# Altium project ESP32-power-controller.PrjPcb (part 1 of 2)
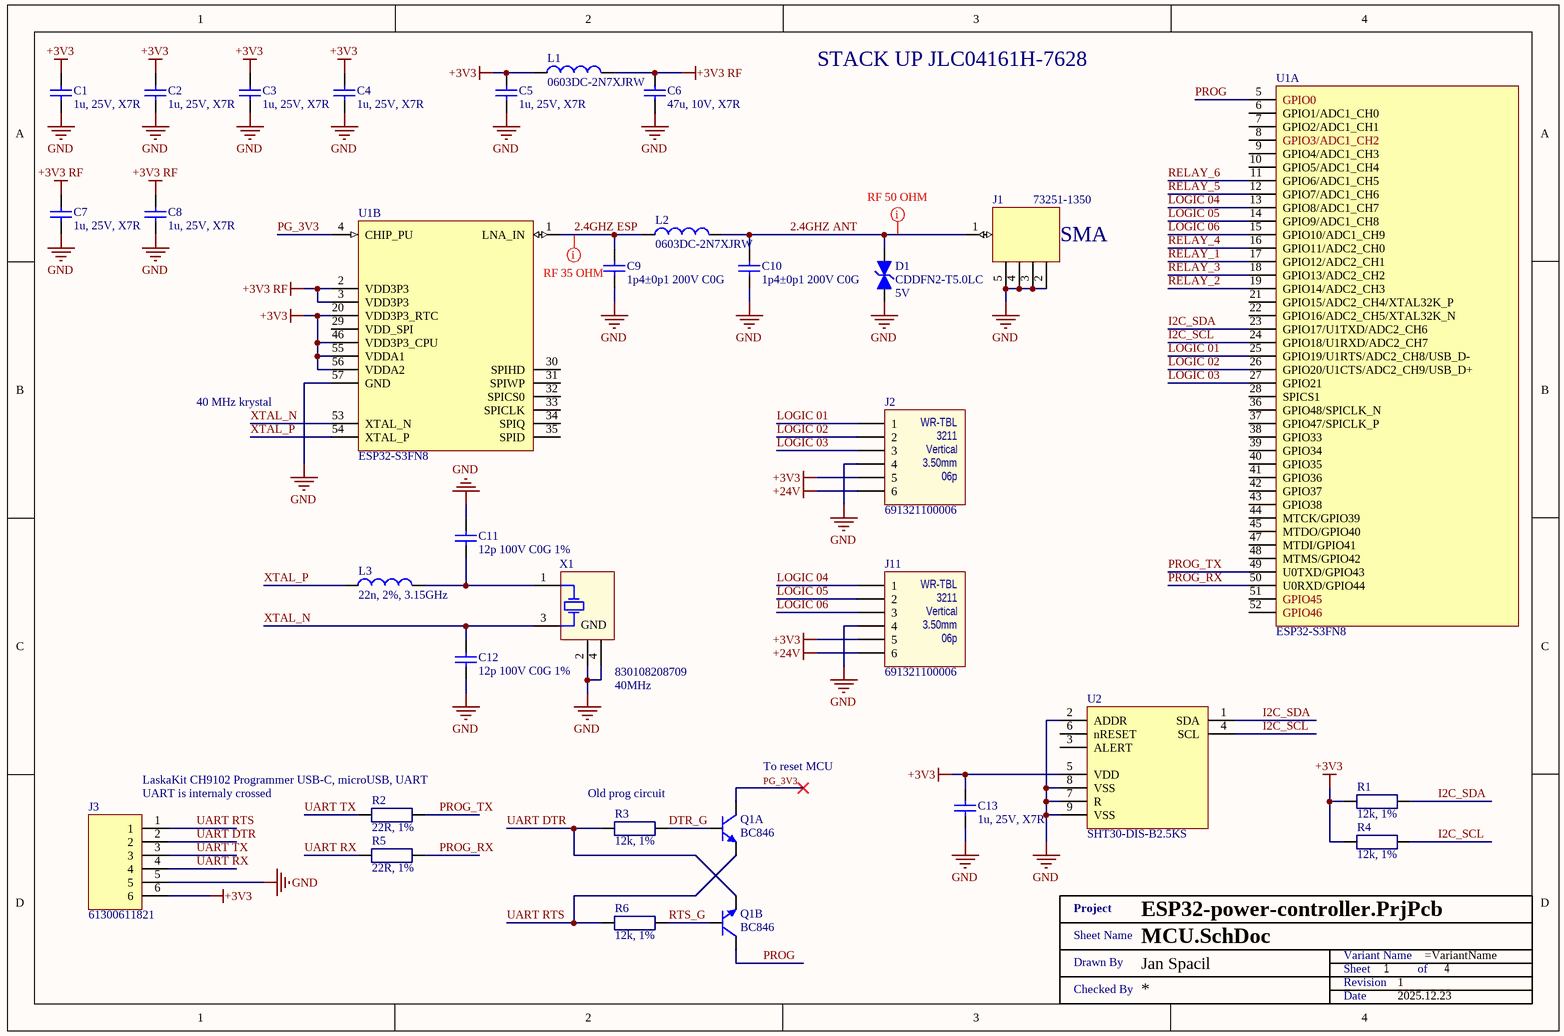
[diagram p0: MCU.SchDoc]
Revision: 1; DrawnBy: Jan Spacil; Date: 2025.12.23
4 sheets, 117 parts. Net scope: global (net labels, ports and power ports of the same name join across sheets).
Board file: Pwr_ctrl.PcbDoc
Sheets:
  MCU.SchDoc
  Relays.SchDoc
  SMPS_3V3.SchDoc
  Power_input.SchDoc

## Sheet MCU.SchDoc
size A4; DocumentNumber: 1; SheetNumber: 1; SheetTotal: 4

### Parts
(Parts that share a designator on the sheet are numbered #1, #2 ... from top to bottom, then left to right.)
C1  1u, 25V, X7R  [SMD0603]
C2  1u, 25V, X7R  [SMD0603]
C3  1u, 25V, X7R  [SMD0603]
C4  1u, 25V, X7R  [SMD0603]
C5  1u, 25V, X7R  [SMD0603]
C6  47u, 10V, X7R  [SMD1210]
C7  1u, 25V, X7R  [SMD0603]
C8  1u, 25V, X7R  [SMD0603]
C9  1p4±0p1 200V C0G  [SMD0603]
C10  1p4±0p1 200V C0G  [SMD0603]
C11  12p 100V C0G 1%  [SMD0603]
C12  12p 100V C0G 1%  [SMD0603]
C13  1u, 25V, X7R  [SMD0603]
D1  CDDFN2-T5.0LC  Operating Supply Voltage: 5V  [CDDFN2-T5.0LC]
J1  73251-1350  [73251-1350]
J2  691321100006  [691321100006]
J3  61300611821  [61300611821]
J11  691321100006  [691321100006]
L1  0603DC-2N7XJRW  [SMD0603 - L]
L2  0603DC-2N7XJRW  [SMD0603 - L]
L3  22n, 2%, 3.15GHz  [SMD0603 - L]
Q1  BC846  [SOT363]  (parts A,B of 2)
R1  12k, 1%  [SMD0603 - R]
R2  22R, 1%  [SMD0603 - R]
R3  12k, 1%  [SMD0603 - R]
R4  12k, 1%  [SMD0603 - R]
R5  22R, 1%  [SMD0603 - R]
R6  12k, 1%  [SMD0603 - R]
U1  ESP32-S3FN8  [QFN40P700X700X90_HS-57N]  (parts A,B of 2)
U2  SHT30-DIS-B2.5KS  [DFN08 - 2.5X2.5MM]
X1  830108208709  Frequency: 40MHz  [CFPX-218]
XX?#1  Title 1  (value not drawn)  (graphical)

### Nets
+3V3: C1.2 C2.2 C3.2 C4.2 C5.2 C13.2 J2.5 J3.6 J11.5 L1.1 R1.2 R4.2 U1.20(VDD3P3_RTC) U1.46(VDD3P3_CPU) U1.55(VDDA1) U1.56(VDDA2) U2.5(VDD)
+3V3 RF: C6.1 C7.2 C8.2 L1.2 U1.2(VDD3P3) U1.3(VDD3P3)
+24V: J2.6 J11.6
GND: C1.1 C2.1 C3.1 C4.1 C5.1 C6.2 C7.1 C8.1 C9.1 C10.1 C11.2 C12.1 C13.1 D1.2 J1.2(GND) J1.3(GND) J1.4(GND) J1.5(GND) J2.4 J3.5 J11.4 U1.57(GND) U2.2(ADDR) U2.7(R) U2.8(VSS) U2.9(VSS) X1.2(GND) X1.4(GND)
2.4GHZ ANT: C10.2 D1.1 J1.1(S) L2.2
2.4GHZ ESP: C9.2 L2.1 U1.1(LNA_IN)
DTR_G: Q1.5(B) R3.1
I2C_SCL: R4.1 U1.24(GPIO18/U1RXD/ADC2_CH7) U2.4(SCL)
I2C_SDA: R1.1 U1.23(GPIO17/U1TXD/ADC2_CH6) U2.1(SDA)
LOGIC 01: J2.1 U1.25(GPIO19/U1RTS/ADC2_CH8/USB_D-)
LOGIC 02: J2.2 U1.26(GPIO20/U1CTS/ADC2_CH9/USB_D+)
LOGIC 03: J2.3 U1.27(GPIO21)
LOGIC 04: J11.1 U1.13(GPIO8/ADC1_CH7)
LOGIC 05: J11.2 U1.14(GPIO9/ADC1_CH8)
LOGIC 06: J11.3 U1.15(GPIO10/ADC1_CH9)
PG_3V3: Q1.3(C) U1.4(CHIP_PU)
PROG: Q1.6(C) U1.5(GPIO0)
PROG_RX: R5.2 U1.50(U0RXD/GPIO44)
PROG_TX: R2.2 U1.49(U0TXD/GPIO43)
RELAY_1: U1.17(GPIO12/ADC2_CH1)
RELAY_2: U1.19(GPIO14/ADC2_CH3)
RELAY_3: U1.18(GPIO13/ADC2_CH2)
RELAY_4: U1.16(GPIO11/ADC2_CH0)
RELAY_5: U1.12(GPIO7/ADC1_CH6)
RELAY_6: U1.11(GPIO6/ADC1_CH5)
RTS_G: Q1.2(B) R6.1
UART DTR: J3.2 Q1.1(E) R3.2
UART RTS: J3.1 Q1.4(E) R6.2
UART RX: J3.4 R5.1
UART TX: J3.3 R2.1
XTAL_N: C12.2 U1.53(XTAL_N) X1.3(X2)
XTAL_P: L3.1 U1.54(XTAL_P)
NetC11_1: C11.1 L3.2 X1.1(X1)

Not connected (* = marked no-connect by the designer): U1 6(GPIO1/ADC1_CH0) 7(GPIO2/ADC1_CH1) 8(GPIO3/ADC1_CH2) 9(GPIO4/ADC1_CH3) 10(GPIO5/ADC1_CH4) 21(GPIO15/ADC2_CH4/XTAL32K_P) 22(GPIO16/ADC2_CH5/XTAL32K_N) 28(SPICS1) 29(VDD_SPI) 30(SPIHD) 31(SPIWP) 32(SPICS0) 33(SPICLK) 34(SPIQ) 35(SPID) 36(GPIO48/SPICLK_N) 37(GPIO47/SPICLK_P) 38(GPIO33) 39(GPIO34) 40(GPIO35) 41(GPIO36) 42(GPIO37) 43(GPIO38) 44(MTCK/GPIO39) 45(MTDO/GPIO40) 47(MTDI/GPIO41) 48(MTMS/GPIO42) 51(GPIO45) 52(GPIO46); U2 3(ALERT) 6(nRESET)

### Layout directives
net class RF 35 OHM: 2.4GHZ ESP
net class RF 50 OHM: 2.4GHZ ANT

### Notes on the sheet
- STACK UP JLC04161H-7628
- 40 MHz krystal
- LaskaKit CH9102 Programmer USB-C, microUSB, UART
- (near Q1) To reset MCU
- (near J3) UART is internaly crossed
- Old prog circuit
- (in symbol 691321100006) WR-TBL; 3211; 3.50mm; 06p
- (in symbol Title 1) Project; Sheet Name; Variant Name; Drawn By; Sheet; of; Revision; Checked By; Date

### Library data of the parts
C1-C5 C7 C8 C13 = CGA3E1X7R1E105K080AC: CAP CER 1UF 25V X7R 0603; Manufacturer: TDK Corporation; Tolerance: ±10%; Manufacturer Part Number: CGA3E1X7R1E105K080AC; RoHS: RoHS Compliant; Category: Capacitors; Stock 1: 109509; Pricing 1: 1=0.2, 10=0.135, 100=0.0686, 500=0.04696, 1000=0.04154 (USD); Packaging: Cut Tape (CT); Part Status: Active; Voltage - Rated: 25V; Temperature Coefficient: X7R; Operating Temperature: -55°C ~ 125°C; Features: -; Ratings: AEC-Q200; Applications: Automotive; Failure Rate: -; Mounting Type: Surface Mount, MLCC; Package / Case: 0603 (1608 Metric); Size / Dimension: 0.063" L x 0.032" W (1.60mm x 0.80mm); Height - Seated (Max): -; Thickness (Max): 0.035" (0.90mm); Lead Spacing: -; Lead Style: -; ComponentLink1URL: https://product.tdk.com/info/en/catalog/datasheets/mlcc_automotive_general_en.pdf; ComponentLink1Description: https://product.tdk.com/info/en/catalog/datasheets/mlcc_automotive_general_en.pdf; Capacitance: 1u; Supplier 1: Mouser; Supplier Part Number 1: 810-CGA3E1X7R1E105K; Supplier 2: Farnell; Supplier Part Number 2: 2346962; Supplier 3: Digi-Key; Supplier Part Number 3: 445-6931-1-ND
C6 = CL32B476MPJNNNE: Cap Ceramic 47uF 10V X7R 20% Pad SMD 1210 125C T/R; Manufacturer: Samsung; Supplier 1: Mouser; Supplier Part Number 1: 187-CL32B476MPJNNNE; Manufacturer Part Number: CL32B476MPJNNNE; RoHS: Yes; Category: Ceramic Capacitors; Stock 1: 61232; Pricing 1: 1=0.51, 10=0.377, 50=0.377, 100=0.263, 1000=0.198, 10000=0.163 (USD); Case/Package: 1210; Dielectric: X7R; Voltage Rating (DC): 10V; Tolerance: 20%; Value: 47uF; RoHS Compliant: Yes; ComponentLink1URL: http://www.samsungsem.com/kr/support/library/product-catalog/__icsFiles/afieldfile/2014/11/13/MLCC.pdf?src-supplier=Avnet; ComponentLink1Description: http://www.samsungsem.com/kr/support/library/product-catalog/__icsFiles/afieldfile/2014/11/13/MLCC.pdf?src-supplier=Avnet; Supplier 2: Arrow Electronics; Supplier Part Number 2: CL32B476MPJNNNE
C9 C10 = 06032U1R4BAT2A: 0603 200 V 1.4 pF ±0.1% Tolerance C0G Multilayer Ceramic Capacitor; Manufacturer: Kyocera AVX; Capacitance: 1p4; Supplier 1: Mouser; Supplier Part Number 1: 581-06032U1R4BAT2A; Manufacturer Part Number: 06032U1R4BAT2A; RoHS: Yes; Category: Ceramic Capacitors; Stock 1: 10860; Pricing 1: 1=0.3, 10=0.202, 50=0.202, 100=0.115, 1000=0.071, 10000=0.055 (USD); Mounting Technology: Surface Mount; Case/Package: 0603; Case Code (Metric): 1608; Case Code (Imperial): 0603; Weight: 7.1E-05oz; Min Operating Temperature: -55°C; Max Operating Temperature: 125°C; Voltage Rating: 200V; Packaging: Tape and Reel; Voltage Rating (DC): 200V; Dielectric: C0G; Termination: SMD/SMT; Series: U; Construction: Flat; Length: 1.6mm; Width: 0.81mm; Depth: 0.76mm; Radiation Hardening: No; Lead Free: Lead Free; RoHS Compliant: Yes; ComponentLink1URL: https://datasheet.ciiva.com/207/useries-207425.pdf?src-supplier=Digi-Key; ComponentLink1Description: https://datasheet.ciiva.com/207/useries-207425.pdf?src-supplier=Digi-Key; ComponentLink2URL: https://datasheet.ciiva.com/11572/useries-11572969.pdf?src-supplier=Avnet; ComponentLink2Description: https://datasheet.ciiva.com/11572/useries-11572969.pdf?src-supplier=Avnet
C11 C12 = 06031U120FAT2A: Cap Ceramic 12pF 100V C0G 1% SMD 0603 125°C T/R; Manufacturer: Kyocera AVX; Supplier 1: Mouser; Supplier Part Number 1: 581-06031U120FAT2A; Manufacturer Part Number: 06031U120FAT2A; RoHS: Yes; Category: Ceramic Capacitors; Stock 1: 6418; Pricing 1: 1=0.33, 10=0.227, 50=0.227, 100=0.137, 1000=0.087, 10000=0.07 (USD); Mounting Technology: Surface Mount; Case/Package: 0603; Case Code (Metric): 1608; Case Code (Imperial): 0603; Min Operating Temperature: -55°C; Max Operating Temperature: 125°C; Packaging: Tape and Reel; Capacitance: 12p; Tolerance: 1%; Package Quantity: 4000; Voltage Rating: 100V; Voltage Rating (DC): 100V; Dielectric: C0G; Termination: SMD/SMT; Series: U; Construction: Flat; Length: 1.6mm; Width: 0.81mm; Depth: 0.76mm; Radiation Hardening: No; RoHS Compliant: Yes; ComponentLink1URL: https://datasheet.ciiva.com/208/useries-208490.pdf?src-supplier=Digi-Key; ComponentLink1Description: https://datasheet.ciiva.com/208/useries-208490.pdf?src-supplier=Digi-Key
D1 = CDDFN2-T5.0LC: TVS DIODE 5VWM 25VC DFN2; Manufacturer: Bourns; Direction: Bidirectional; Max Surge Current: 5A; Breakdown Voltage: 7V; Clamping Voltage: 15V; Number of Channels: 1; Power Line Protection: No; Leakage Current: 1uA; Diode Type: ZENER; Capacitance: 12pF; Element Configuration: Single; Supplier 1: Mouser; Supplier Part Number 1: 652-CDDFN2-T5.0LC; Manufacturer Part Number: CDDFN2-T5.0LC; RoHS: Yes; Category: TVS Diodes; Stock 1: 37803; Pricing 1: 1=0.43000, 10=0.34500, 50=0.34500, 100=0.24100, 1000=0.15700, 10000=0.14100 (USD); Mount: Surface Mount; Case/Package: DFN; Number of Pins: 2; Contact Plating: Gold; Min Operating Temperature: -40°C; Max Operating Temperature: 85°C; Packaging: Tape and Reel; Package Quantity: 1; Polarity: Bidirectional; Termination: SMD/SMT; Reverse Standoff Voltage: 5V; Number of Bidirectional Channels: 1; Min Breakdown Voltage: 7V; Working Voltage: 5V; Resistor Type: Zener; Series: -; Max Breakdown Voltage: 7V; Length: 1mm; Radiation Hardening: No; RoHS Compliant: Yes; REACH SVHC: No SVHC; ComponentLink1URL: https://datasheet.ciiva.com/6817/1758341-6817680.pdf?src-supplier=Newark; ComponentLink1Description: https://datasheet.ciiva.com/6817/1758341-6817680.pdf?src-supplier=Newark; ComponentLink2URL: https://datasheet.ciiva.com/11193/cddfn2-t5-0lc-11193904.pdf?src-supplier=Avnet; ComponentLink2Description: https://datasheet.ciiva.com/11193/cddfn2-t5-0lc-11193904.pdf?src-supplier=Avnet; ComponentLink3URL: https://datasheet.ciiva.com/4507/cddfn2-txxc-71882-4507683.pdf?src-supplier=Mouser; ComponentLink3Description: https://datasheet.ciiva.com/4507/cddfn2-txxc-71882-4507683.pdf?src-supplier=Mouser; ComponentLink4URL: https://datasheet.ciiva.com/335/cddfn2-t5-0lc-335432.pdf?src-supplier=Digi-Key; ComponentLink4Description: https://datasheet.ciiva.com/335/cddfn2-t5-0lc-335432.pdf?src-supplier=Digi-Key; ComponentLink5URL: https://datasheet.ciiva.com/335/cddfn2-t5-0lc-335433.pdf?src-supplier=Digi-Key; ComponentLink5Description: https://datasheet.ciiva.com/335/cddfn2-t5-0lc-335433.pdf?src-supplier=Digi-Key; ComponentLink6URL: https://datasheet.ciiva.com/335/cddfn2-t5-0lc-335434.pdf?src-supplier=Digi-Key; ComponentLink6Description: https://datasheet.ciiva.com/335/cddfn2-t5-0lc-335434.pdf?src-supplier=Digi-Key; Supplier 2: Farnell; Supplier Part Number 2: 1860785; Supplier 3: Digi-Key; Supplier Part Number 3: CDDFN2-T5.0LCCT-ND; Supplier 4: Arrow Electronics; Supplier Part Number 4: CDDFN2-T5.0LC
J1 = 73251-1350: MOLEX   73251-1350.   RF/COAXIAL, SMA JACK, STRAIGHT, 50 OHM, SMD; Body Plating: Gold; Body Material: Brass; Impedance: 50R; Connector Type: SMA,Coaxial; Gender: Female; Supplier 1: Mouser; Supplier Part Number 1: 538-73251-1350; Manufacturer: Molex; Manufacturer Part Number: 73251-1350; RoHS: Yes; Category: RF / Coaxial Connectors; Stock 1: 5183; Pricing 1: 1=2.88000, 10=2.33000, 50=2.33000, 100=2.01000, 1000=1.66000, 10000=1.66000 (USD); Case/Package: SMA; Contact Material: Copper; Contact Plating: Gold; Insulation Material: Teflon; Package Quantity: 1600; Packaging: Tray; Termination: Solder; Series: 73251; Orientation: Straight; Length: 6.35mm; Depth: 6.35mm; Radiation Hardening: No; RoHS Compliant: Yes; REACH SVHC: Unknown; Halogen Free: Low Halogen; ComponentLink1URL: https://datasheet.ciiva.com/22652/1443748-22652884.pdf?src-supplier=Element14; ComponentLink1Description: https://datasheet.ciiva.com/22652/1443748-22652884.pdf?src-supplier=Element14; ComponentLink2URL: https://datasheet.ciiva.com/5718/1716114-5718582.pdf?src-supplier=Farnell; ComponentLink2Description: https://datasheet.ciiva.com/5718/1716114-5718582.pdf?src-supplier=Farnell; ComponentLink3URL: https://datasheet.ciiva.com/23673/1763868-23673641.pdf?src-supplier=Newark; ComponentLink3Description: https://datasheet.ciiva.com/23673/1763868-23673641.pdf?src-supplier=Newark; ComponentLink4URL: https://datasheet.ciiva.com/15226/getdatasheetpartid-152891-15226055.pdf?src-supplier=Verical; ComponentLink4Description: https://datasheet.ciiva.com/15226/getdatasheetpartid-152891-15226055.pdf?src-supplier=Verical; Supplier 2: Farnell; Supplier Part Number 2: 2781996; Supplier 3: Digi-Key; Supplier Part Number 3: WM9458-ND
J2 J11 = 691321100006: WR-TBL Series 3211 - 3.50 mm Vertical PCB Header; Manufacturer: Wurth Electronics; Current Rating: 10.5A; Number of Positions Per Level: 6; Number of Levels: 1; Current: 10A; Voltage: 300V; Pitch: 0.138inch; Supplier: Mouser; Supplier Part Number: 710-691321100006; Manufacturer Part Number: 691321100006; RoHS: Yes; Category: Terminal Blocks; Stock: 612; Pricing: 1=1.32, 10=1.18, 50=1.02, 100=0.914, 1000=0.805, 10000=0.804 (USD); Mounting Technology: Through Hole; Color: Green; Contact Material: Brass; Number of Rows: 1; Package Quantity: 520; Packaging: Bulk; Termination: Solder; Number of Contacts: 6; Contact Gender: Male; Orientation: Vertical; Series: WR-TBL Series 3211; Length: 7mm; Width: 25.6mm; Height: 12.7mm; RoHS Compliant: Yes; Reach SVHC Compliant: Unknown; ComponentLink1URL: https://datasheet.ciiva.com/8043/1442231-8043549.pdf?src-supplier=Element14; ComponentLink1Description: https://datasheet.ciiva.com/8043/1442231-8043549.pdf?src-supplier=Element14; ComponentLink2URL: https://datasheet.ciiva.com/796/6913211000xx-796060.pdf?src-supplier=Digikey; ComponentLink2Description: https://datasheet.ciiva.com/796/6913211000xx-796060.pdf?src-supplier=Digikey; ComponentLink3URL: https://datasheet.ciiva.com/48692/001088701-da-01-en-wr-tbl-terminal-block3211-691321100006-48692844.pdf?src-supplier=Conrad; ComponentLink3Description: https://datasheet.ciiva.com/48692/001088701-da-01-en-wr-tbl-terminal-block3211-691321100006-48692844.pdf?src-supplier=Conrad; Supplier 1: Mouser; Supplier Part Number 1: 710-691321100006; Supplier 2: Farnell; Supplier Part Number 2: 1841313; Supplier 3: Digikey; Supplier Part Number 3: 732-2767-ND
J3 = 61300611821: WR-PHD 2.54 mm Socket Header; Manufacturer: Wurth Electronics; Gender: Female; Supplier 1: Mouser; Supplier Part Number 1: 710-61300611821; Manufacturer Part Number: 61300611821; RoHS: Yes; Stock 1: 1484; Pricing 1: 1=0,36000, 10=0,35900, 50=0,27900, 100=0,25000, 1000=0,21900, 10000=0,19000 (USD); Contact Material: Copper Alloy; RoHS Compliant: Yes; Supplier 2: Farnell; Supplier Part Number 2: 2827893
L1 L2 = 0603DC-2N7XJRW: RF Inductor, ceramic core, 5% tol, SMT, RoHS, halogen-free; Manufacturer: Coilcraft; Inductance: 2n7; Supplier 1: Mouser; Supplier Part Number 1: 994-0603DC-2N7XJRW; Manufacturer Part Number: 0603DC-2N7XJRW; RoHS: Yes; Category: Fixed Inductors; Stock 1: 6487; Pricing 1: 1=0.89, 10=0.89, 50=0.89, 100=0.89, 1000=0.56, 10000=0.475 (USD); Supplier 2: Farnell; Supplier Part Number 2: 3639697
L3 = 0603HP-22NXGLW: Ind Chip Wirewound 22nH 2% 250MHz 44Q-Factor Ceramic 850mA 0603 Punched Paper T/R; Manufacturer: Coilcraft; Q Factor: 88; DC Resistance (DCR): 140mR; Supplier 1: Mouser; Supplier Part Number 1: 994-0603HP-22NXGLW; Manufacturer Part Number: 0603HP-22NXGLW; Stock 1: 1728; Pricing 1: 1=1.18000, 10=1.18000, 50=1.18000, 100=1.18000, 200=0.89000, 500=0.66000, 1000=0.44000, 2000=0.40500 (USD); RoHS: Yes; Mount: Surface Mount; Case/Package: 0603; Core Material: Ceramic; Min Operating Temperature: -40°C; Max Operating Temperature: 125°C; Packaging: Tape and Reel; Tolerance: 2%; Inductance: 22n; Max DC Current: 850mA; Self Resonant Frequency: 3.15GHz; Termination: SMD/SMT; Test Frequency: 250MHz; Inductance Tolerance: 2%; Current Rating: 850mA; Length: 1.75mm; Height: 0.94mm; Width: 1.09mm; Lead Free: Contains Lead; REACH SVHC: Unknown; ComponentLink1URL: https://datasheet.ciiva.com/22680/1681881-22680857.pdf?src-supplier=Element14; ComponentLink1Description: https://datasheet.ciiva.com/22680/1681881-22680857.pdf?src-supplier=Element14; ComponentLink2URL: https://datasheet.ciiva.com/22680/1681881-22680858.pdf?src-supplier=Element14; ComponentLink2Description: https://datasheet.ciiva.com/22680/1681881-22680858.pdf?src-supplier=Element14; ComponentLink3URL: https://datasheet.ciiva.com/22709/1681881-22709407.pdf?src-supplier=Element14; ComponentLink3Description: https://datasheet.ciiva.com/22709/1681881-22709407.pdf?src-supplier=Element14; Supplier 2: Farnell; Supplier Part Number 2: 2286150
Q1 = BC846 Dual: Manufacturer: NXP; Manufacturer Part Number: BC846BS; Transistor Polarity: NPN; Transistor Case Style: SOT-363; Transition Frequency ft: 100; DC Current Gain hFE: 200; Collector Emitter Voltage V(br)ceo: 65; No. of Pins: 6; SVHC: No SVHC (17-Dec-2015); Farnell: http://cz.farnell.com/on-semiconductor/bc846bdw1t1g/transistor-npn-65v-100ma-sot-363/dp/2317636; RoHS: YES; Supplier 1: Farnell; Supplier Part Number 1: 2317636; Operating Temperature Max: 150; DC Collector Current: 100; Power Dissipation Pd: 200; MSL: MSL 1 - Unlimited; Automotive Qualification Standard: -; Product Range: -; Operating Temperature Min: -55; Operating Temperature Range: -55°C to +150°C<!--FANDB--><div class="features-and-benefits-container"><div class="features-and-benefits-description"><span class="features-benefits-value">The BC846BS is a 100mA NPN-NPN General Purpose Transistor Pair in a very small surface-mount plastic package. It is suitable for use with general purpose switching and amplification.</span></div><div class="features-and-benefits-list"><ul class="features-and-benefits-list-list"><li class="features-and-benefits-list-item">Low collector capacitance</li><li class="features-and-benefits-list-item">Low collector-emitter saturation voltage</li><li class="features-and-benefits-list-item">Closely matched current gain</li><li class="features-and-benefits-list-item">Reduces number of components and board space</li><li class="features-and-benefits-list-item">No mutual interference between the transistors</li><li class="features-and-benefits-list-item">AEC-Q101 qualified</li><li class="features-and-benefits-list-item">NPN-NPN complement is BC846BPN</li><li class="features-and-benefits-list-item">PNP-PNP complement is BC856
R1 R3 R4 R6 = RCS060312K0FKEA: RES SMD 12K OHM 1% 1/4W 0603; Manufacturer: Vishay Dale; Power (Watts): 0.25W, 1/4W; Temperature Coefficient: ±100ppm/°C; Manufacturer Part Number: RCS060312K0FKEA; RoHS: RoHS Compliant; Category: Resistors; Stock 1: 0; Pricing 1: 5000=0.01664, 10000=0.01513 (USD); Packaging: Tape & Reel (TR); Part Status: Active; Tolerance: ±1%; Composition: Thick Film; Features: Automotive AEC-Q200, Pulse Withstanding; Operating Temperature: -55°C ~ 155°C; Package / Case: 0603 (1608 Metric); Supplier Device Package: 0603; Size / Dimension: 0.061" L x 0.033" W (1.55mm x 0.85mm); Height - Seated (Max): 0.020" (0.50mm); Failure Rate: -; ComponentLink1URL: http://www.vishay.com/docs/20065/rcse3.pdf; ComponentLink1Description: http://www.vishay.com/docs/20065/rcse3.pdf; Resistance: 12k; Supplier 1: Mouser; Supplier Part Number 1: 71-RCS060312K0FKEA; Supplier 2: Farnell; Supplier Part Number 2: 3294375; Supplier 3: Digi-Key; Supplier Part Number 3: RCS060312K0FKEA-ND
R2 R5 = RC0603FR-0722RL: YAGEO (PHYCOMP) - RC0603FR-0722RL - RES, THICK FILM, 22R, 1%, 0.1W, 0603; Voltage Rating: 50; Resistor Case Style: 0603 [1608 Metric]; Power Rating: 100; Product Range: RC Series; Temperature Coefficient: ± 100; SVHC: No SVHC (20-Jun-2016); External Depth: 0.45; External Length / Height: 1.6; External Width: 0.8; Full Power Rating Temperature: 70; No. of Pins: 2; Reel Quantity: 5000; Resistor Mounting: Surface Mount Device; Voltage Rating V DC: 50V<!--FANDB--><div class="features-and-benefits-container"><div class="features-and-benefits-desc-container"><span class="features-and-benefits-container-desc">SMD Chip Resistor, Thick Film, 22 ohm, 50 V, 0603 [1608 Metric], 100 mW, ± 1%, RC Series</span></div><div class="features-and-benefits-description"><span class="features-benefits-value">The Yageo RC_L series resistors are general purpose thick film chip resistors with lead free terminations made by thick film process. The resistance range includes E24 and E96 decade values from 1ohm to 100Mohm. These resistors are constructed on top of a high grade ceramic body.</span></div><div class="features-and-benefits-list"><ul class="features-and-benefits-list-list"><li class="features-and-benefits-list-item">EIA 0075, 0100, 0201, 0402, 0603, 0805, 1206, 1210, 1218, 2010, 2512 case sizes available</li><li class="features-and-benefits-list-item">Small chip sizes save PCB space</li><li class="features-and-benefits-list-item">Rated voltage range of 10V to 200V</li><li class="features-and-benefits-list-item">Maximum power rating of 2W</li><li class="features-and-benefits-list-item">Available in ±0.1%, ±0.5%, ±1% and ±5% tolerance</li><li class="features-and-benefits-list-item">High component and equipment reliability</li><li class="features-and-benefits-list-item">Forbidden materials are not used in products/production</li><li class="features-and-benefits-list-item">-55°C to 155°C temperature range for RC0402 to RC2512 and -55°C to 125°C for RC0075 to RC0201; Manufacturer: YAGEO (PHYCOMP); Manufacturer Part Number: RC0603FR-0722RL; RoHS: YES; Stock 1: 33025; Pricing 1: 10=0.0102, 100=0.0068, 500=0.0051, 1000=0.0041, 2500=0.0034 (GBP); Resistance: 22R; Resistance Tolerance: ± 1%; Packaging: Cut Tape; Resistor Element Material: Thick Film; Automotive Qualification Standard: -; MSL: MSL 1 - Unlimited; Operating Temperature Max: 155; Operating Temperature Min: -55; Operating Temperature Range: -55°C to +155; Temperature Coeff. +: 100; Temperature Coeff. -: 100; Tolerance +: 1%; Tolerance -: 1%; ComponentLink1URL: http://www.farnell.com/datasheets/2167052.pdf; ComponentLink1Description: http://www.farnell.com/datasheets/2167052.pdf; ComponentLink2URL: http://www.farnell.com/cad/1555248.zip; ComponentLink2Description: http://www.farnell.com/cad/1555248.zip; Supplier 1: Mouser; Supplier Part Number 1: 603-RC0603FR-0722RL; Supplier 2: Farnell; Supplier Part Number 2: 9238280; Supplier 3: Digi-Key; Supplier Part Number 3: 311-22.0HRCT-ND
U1 = ESP32-S3FN8: WiFi Modules - 802.11 SMD IC , Dual-Core MCU, Wi-Fi 2.4G BLE 5.0 combo, 8 MB Oc; Manufacturer: Espressif Systems; Supplier 1: Mouser; Supplier Part Number 1: 356-ESP32-S3FN8; Manufacturer Part Number: ESP32-S3FN8; RoHS: No; Category: Uncategorized; Stock 1: 14517; Pricing 1: 1=2.28, 10=2.28, 50=2.28, 100=2.28, 1000=2.28, 10000=2.28 (USD); Supplier 2: Digi-Key; Supplier Part Number 2: 1965-ESP32-S3FN8-ND; Supplier 3: TME; Supplier Part Number 3: ESP32-S3FN8
U2 = SHT30-DIS-B2.5KS: Humidity/Temperature Sensor Digital Serial (I2C) Automotive 8-Pin TDFN EP T/R; Manufacturer: Sensirion; Supplier 1: Mouser; Supplier Part Number 1: 403-SHT30-DIS-B; Manufacturer Part Number: SHT30-DIS-B2.5KS; RoHS: Yes; Category: Temperature and Humidity Sensors; Stock 1: 32113; Pricing 1: 1=3.19, 10=2.19, 50=2.19, 100=2.09, 1000=1.67, 10000=1.54 (USD); ComponentLink1URL: https://media.digikey.com/pdf/Data%20Sheets/Sensirion%20PDFs/HT_DS_SHT3x_DIS.pdf?src-supplier=Digi-Key; ComponentLink1Description: https://media.digikey.com/pdf/Data%20Sheets/Sensirion%20PDFs/HT_DS_SHT3x_DIS.pdf?src-supplier=Digi-Key; ComponentLink2URL: https://datasheet.octopart.com/SHT30-DIS-B2.5KS-Sensirion-datasheet-166817248.pdf?src-supplier=Future+Electronics; ComponentLink2Description: https://datasheet.octopart.com/SHT30-DIS-B2.5KS-Sensirion-datasheet-166817248.pdf?src-supplier=Future+Electronics; Supplier 2: Arrow Electronics; Supplier Part Number 2: SHT30-DIS-B2.5KS; Supplier 3: Digi-Key; Supplier Part Number 3: 1649-1009-1-ND
X1 = 830108208709: Parallel - Fundamental Quartz Crystal, 40MHz Nom; Manufacturer: Wurth Electronics; Supplier: Mouser; Supplier Part Number: 710-830108208709; Manufacturer Part Number: 830108208709; RoHS: Yes; Category: Uncategorized; Stock: 1766; Pricing: 1=0.59, 10=0.538, 50=0.515, 100=0.492, 1000=0.422, 10000=0.375 (USD); Supplier 1: Mouser; Supplier Part Number 1: 710-830108208709; Supplier 2: Digikey; Supplier Part Number 2: 1923-830108208709CT-ND; Supplier 3: Rs; Supplier Part Number 3: 197500

## Sheet Relays.SchDoc
size A4; DocumentNumber: 2; SheetNumber: 2; SheetTotal: 4
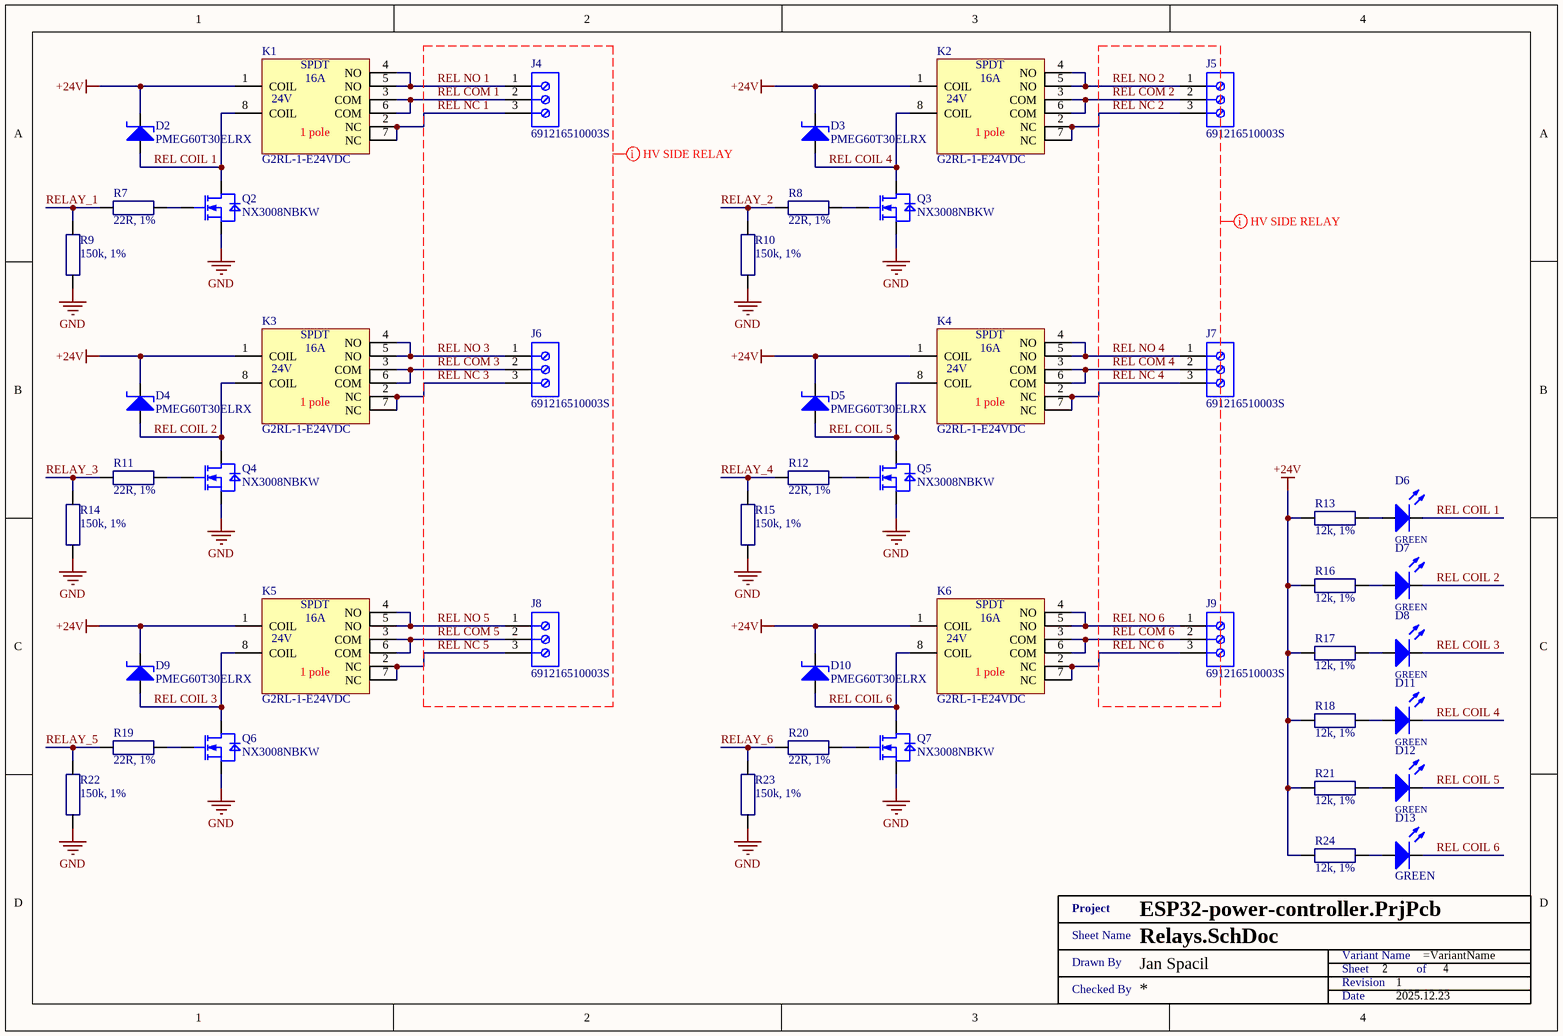
[diagram p1: Relays.SchDoc]

### Parts
(Parts that share a designator on the sheet are numbered #1, #2 ... from top to bottom, then left to right.)
D2  PMEG60T30ELRX  [SOD123]
D3  PMEG60T30ELRX  [SOD123]
D4  PMEG60T30ELRX  [SOD123]
D5  PMEG60T30ELRX  [SOD123]
D6  GREEN  [MCL-S270]
D7  GREEN  [MCL-S270]
D8  GREEN  [MCL-S270]
D9  PMEG60T30ELRX  [SOD123]
D10  PMEG60T30ELRX  [SOD123]
D11  GREEN  [MCL-S270]
D12  GREEN  [MCL-S270]
D13  GREEN  [MCL-S270]
J4  691216510003S  [691216510003S]
J5  691216510003S  [691216510003S]
J6  691216510003S  [691216510003S]
J7  691216510003S  [691216510003S]
J8  691216510003S  [691216510003S]
J9  691216510003S  [691216510003S]
K1  G2RL-1-E24VDC  [G2RL]
K2  G2RL-1-E24VDC  [G2RL]
K3  G2RL-1-E24VDC  [G2RL]
K4  G2RL-1-E24VDC  [G2RL]
K5  G2RL-1-E24VDC  [G2RL]
K6  G2RL-1-E24VDC  [G2RL]
Q2  NX3008NBKW  [SOT323]
Q3  NX3008NBKW  [SOT323]
Q4  NX3008NBKW  [SOT323]
Q5  NX3008NBKW  [SOT323]
Q6  NX3008NBKW  [SOT323]
Q7  NX3008NBKW  [SOT323]
R7  22R, 1%  [SMD0603 - R]
R8  22R, 1%  [SMD0603 - R]
R9  150k, 1%  [SMD0603 - R]
R10  150k, 1%  [SMD0603 - R]
R11  22R, 1%  [SMD0603 - R]
R12  22R, 1%  [SMD0603 - R]
R13  12k, 1%  [SMD0603 - R]
R14  150k, 1%  [SMD0603 - R]
R15  150k, 1%  [SMD0603 - R]
R16  12k, 1%  [SMD0603 - R]
R17  12k, 1%  [SMD0603 - R]
R18  12k, 1%  [SMD0603 - R]
R19  22R, 1%  [SMD0603 - R]
R20  22R, 1%  [SMD0603 - R]
R21  12k, 1%  [SMD0603 - R]
R22  150k, 1%  [SMD0603 - R]
R23  150k, 1%  [SMD0603 - R]
R24  12k, 1%  [SMD0603 - R]
XX?#2  Title 1  (value not drawn)  (graphical)

### Nets
+24V: D2.2(K) D3.2(K) D4.2(K) D5.2(K) D9.2(K) D10.2(K) K1.1(COIL) K2.1(COIL) K3.1(COIL) K4.1(COIL) K5.1(COIL) K6.1(COIL) R13.2 R16.2 R17.2 R18.2 R21.2 R24.2
GND: Q2.2(S) Q3.2(S) Q4.2(S) Q5.2(S) Q6.2(S) Q7.2(S) R9.2 R10.2 R14.2 R15.2 R22.2 R23.2
REL COIL 1: D2.1(A) D6.2(K) K1.8(COIL) Q2.3(D)
REL COIL 2: D4.1(A) D7.2(K) K3.8(COIL) Q4.3(D)
REL COIL 3: D8.2(K) D9.1(A) K5.8(COIL) Q6.3(D)
REL COIL 4: D3.1(A) D11.2(K) K2.8(COIL) Q3.3(D)
REL COIL 5: D5.1(A) D12.2(K) K4.8(COIL) Q5.3(D)
REL COIL 6: D10.1(A) D13.2(K) K6.8(COIL) Q7.3(D)
REL COM 1: J4.2 K1.3(COM) K1.6(COM)
REL COM 2: J5.2 K2.3(COM) K2.6(COM)
REL COM 3: J6.2 K3.3(COM) K3.6(COM)
REL COM 4: J7.2 K4.3(COM) K4.6(COM)
REL COM 5: J8.2 K5.3(COM) K5.6(COM)
REL COM 6: J9.2 K6.3(COM) K6.6(COM)
REL NC 1: J4.3 K1.2(NC) K1.7(NC)
REL NC 2: J5.3 K2.2(NC) K2.7(NC)
REL NC 3: J6.3 K3.2(NC) K3.7(NC)
REL NC 4: J7.3 K4.2(NC) K4.7(NC)
REL NC 5: J8.3 K5.2(NC) K5.7(NC)
REL NC 6: J9.3 K6.2(NC) K6.7(NC)
REL NO 1: J4.1 K1.4(NO) K1.5(NO)
REL NO 2: J5.1 K2.4(NO) K2.5(NO)
REL NO 3: J6.1 K3.4(NO) K3.5(NO)
REL NO 4: J7.1 K4.4(NO) K4.5(NO)
REL NO 5: J8.1 K5.4(NO) K5.5(NO)
REL NO 6: J9.1 K6.4(NO) K6.5(NO)
RELAY_1: R7.1 R9.1
RELAY_2: R8.1 R10.1
RELAY_3: R11.1 R14.1
RELAY_4: R12.1 R15.1
RELAY_5: R19.1 R22.1
RELAY_6: R20.1 R23.1
NetD6_1: D6.1(A) R13.1
NetD7_1: D7.1(A) R16.1
NetD8_1: D8.1(A) R17.1
NetD11_1: D11.1(A) R18.1
NetD12_1: D12.1(A) R21.1
NetD13_1: D13.1(A) R24.1
NetQ2_1: Q2.1(G) R7.2
NetQ3_1: Q3.1(G) R8.2
NetQ4_1: Q4.1(G) R11.2
NetQ5_1: Q5.1(G) R12.2
NetQ6_1: Q6.1(G) R19.2
NetQ7_1: Q7.1(G) R20.2

### Layout directives
net class HV SIDE RELAY: REL COM 1, REL COM 2, REL COM 3, REL COM 4, REL COM 5, REL COM 6, REL NC 1, REL NC 2, REL NC 3, REL NC 4, REL NC 5, REL NC 6, REL NO 1, REL NO 2, REL NO 3, REL NO 4, REL NO 5, REL NO 6

### Notes on the sheet
- (in symbol G2RL-1-E24VDC) 1 pole
- (in symbol Title 1) Project; Sheet Name; Variant Name; Drawn By; Sheet; of; Revision; Checked By; Date

### Library data of the parts
D2-D5 D9 D10 = PMEG60T30ELRX: 60 V, 3 A low leakage current Trench MEGA Schottky barrier rectifier; Manufacturer: Nexperia; Supplier 1: Mouser; Supplier Part Number 1: 771-PMEG60T30ELRX; Manufacturer Part Number: PMEG60T30ELRX; RoHS: No; Stock 1: 115354; Pricing 1: 1=0,46000, 10=0,37500, 50=0,37500, 100=0,25500, 1000=0,14400, 10000=0,11500 (USD); Supplier 2: Farnell; Supplier Part Number 2: 2901049; Supplier 3: Digi-Key; Supplier Part Number 3: 1727-7806-1-ND
D6-D8 D11-D13 = MCL-S270GC: MULTICOMP - MCL-S270GC - LED, 0805, GREEN, 10MCD, 570NM; LED Mounting: SMD; Bulb Size: 1.25mm x 1.4; Forward Current If: 20; Forward Voltage: 2.1; Wavelength Typ: 570; Luminous Intensity: 10; Viewing Angle: 140°; Lens Shape: Rectangular; SVHC: No SVHC (17-Dec-2015); Forward Voltage VF Max: 2.6; LED / Lamp Size: 1.4mm x 1.25; LED Type: Standard; Luminous Intensity Max: 16; Luminous Intensity Min: 4.5; No. of Pins: 2; Peak Forward Current: 100; Peak Wavelength: 568; Reverse Protection Voltage: 5; Voltage Vf Min: 1.7; Voltage Vf Typ: 2.1V<!--FANDB--><div class="features-and-benefits-container"><div class="features-and-benefits-description"><span class="features-benefits-value">The MCL-S270GC is a green SMD LED made of GaP dice. This LED offers water clear rectangular lens and 260°C for 5 seconds lead soldering temperature range 1.6mm from body.</span></div><div class="features-and-benefits-list"><ul class="features-and-benefits-list-list"><li class="features-and-benefits-list-item">-40 to 85; Manufacturer: MULTICOMP; Manufacturer Part Number: MCL-S270GC; RoHS: YES; Stock 1: 80989; Pricing 1: 5=0,145, 25=0,136, 100=0,126, 250=0,0813, 500=0,0645, 2000=0,0559, 5000=0,0496, 20000=0,0434 (GBP); LED Colour: Green; Packaging: Cut Tape; Product Range: -; Automotive Qualification Standard: -; MSL: MSL 3 - 168 hours; Current Rating: 20; Dominant Wavelength: 570; Dominant Wavelength Typ: 570; Forward Current If Max: 20; Luminous Intensity Typ: 10; Operating Temperature Max: 85; Operating Temperature Min: -40; Operating Temperature Range: -40°C to +85; Storage Temperature Max: +100; Storage Temperature Min: -40; ComponentLink1URL: http://www.farnell.com/cad/53028.pdf; ComponentLink1Description: http://www.farnell.com/cad/53028.pdf; ComponentLink2URL: http://www.farnell.com/datasheets/1671537.pdf; ComponentLink2Description: http://www.farnell.com/datasheets/1671537.pdf; Supplier 1: Farnell; Supplier Part Number 1: 1581242; Supplier 2: Newark; Supplier Part Number 2: 14N9356
J4-J9 = 691216510003S: 3 pin WR-TBL Series 2165S - 5.08 mm Horizontal Entry Modular w. Rising Cage Clamp; Manufacturer: Wurth Electronics; Supplier 1: Mouser; Supplier Part Number 1: 710-691216510003S; Manufacturer Part Number: 691216510003S; RoHS: Yes; Category: Terminal Blocks; Stock 1: 1811; Pricing 1: 1=1,51000, 10=1,34000, 50=1,25000, 100=1,15000, 1000=0,85300, 10000=0,85300 (USD); RoHS Compliant: Yes; ComponentLink1URL: http://katalog.we-online.de/em/datasheet/6912165100xxS.pdf?src-supplier=Digi-Key; ComponentLink1Description: http://katalog.we-online.de/em/datasheet/6912165100xxS.pdf?src-supplier=Digi-Key; Supplier 2: Farnell; Supplier Part Number 2: 3767921; Supplier 3: Digi-Key; Supplier Part Number 3: 732-691216510003S-ND
K1-K6 = G2RL-1-E24VDC: Power/Signal Relay, SPDT, Momentary, 0.17A (Coil), 24VDC (Coil), 400mW (Coil), 16A (Contact), 300VDC (Contact), DC Input, AC/DC Output, Through Hole-Straight Mount; Manufacturer: Omron; Coil Current(DC)-Max: 170mA; Coil Operate Voltage(DC): 16.8V; Coil Release Voltage(DC): 2.4V; Coil Resistance: 1.44kR; Coil Voltage(DC)-Max: 24V; Contact AC Max Rating R Load: 16A@440VAC; Contact DC Max Rating R Load: 16A@300VDC; Contact Voltage(AC)-Max: 440V; Contact Voltage(DC)-Max: 300V; Operate Time: 15ms; Release Time: 5ms; Body Breadth: 12.7mm; Body Height: 15.7mm; Body Length or Diameter: 29mm; Reference Standard: UL; Supplier: TME; Supplier Part Number: G2RL-1-E-24DC; Manufacturer Part Number: G2RL-1-E24VDC; RoHS: Yes; Stock: 1286; Pricing: 1=2.11, 5=1.92, 20=1.5 (EUR); Mounting Technology: Through Hole; Min Operating Temperature: -40°C; Max Operating Temperature: 85°C; Coil Power: 400mW; Coil/Input Supply Type: DC; Contact Current(AC)-Max: 16A; Contact Current(DC)-Max: 16A; Contact/Output Supply Type: AC/DC; Relay Action: MOMENTARY; Relay Function: SPDT; Relay Type: POWER/SIGNAL RELAY; Termination: Solder; Reach SVHC Compliant: Yes; RoHS Compliant: Yes; ComponentLink1URL: https://datasheet.ciiva.com:443/pdfs/VipMasterIC/IC/OMRN/OMRN-S-A0001723434/OMRN-S-A0001723434-1.pdf?src-supplier=IHS+Markit; ComponentLink1Description: https://datasheet.ciiva.com:443/pdfs/VipMasterIC/IC/OMRN/OMRN-S-A0001723434/OMRN-S-A0001723434-1.pdf?src-supplier=IHS+Markit; ComponentLink2URL: https://datasheet.ciiva.com/14146/dhrelay-technik-e-14146598.pdf?src-supplier=Distrelec; ComponentLink2Description: https://datasheet.ciiva.com/14146/dhrelay-technik-e-14146598.pdf?src-supplier=Distrelec
Q2-Q7 = NX3008NBKW: NXP - NX3008NBKW - MOSFET, N CH, 30V, 350MA, SOT323; Transistor Polarity: N Channel; Continuous Drain Current Id: 350; Drain Source Voltage Vds: 30; On Resistance Rds(on): 1; Rds(on) Test Voltage Vgs: 4.5; Threshold Voltage Vgs: 900; Power Dissipation Pd: 260; Transistor Case Style: SOT-323; No. of Pins: 3; SVHC: No SVHC (17-Dec-2015); Pulse Current Idm: -0.8; Voltage Vgs th Max: 8; Manufacturer: NXP; Manufacturer Part Number: NX3008NBKW; RoHS: YES; Stock 1: 4764; Pricing 1: 1=0.0425, 25=0.0385, 100=0.0347, 250=0.0334, 500=0.0312, 2000=0.0291, 4000=0.0282, 20000=0.0273 (GBP); Operating Temperature Max: 150; Product Range: -; Automotive Qualification Standard: -; MSL: MSL 1 - Unlimited; Operating Temperature Min: -55; Operating Temperature Range: -55°C to +150; ComponentLink1URL: http://www.farnell.com/datasheets/1508392.pdf; ComponentLink1Description: http://www.farnell.com/datasheets/1508392.pdf; Supplier 1: Mouser; Supplier Part Number 1: 771-NX3008NBKW,115; Supplier 2: Farnell; Supplier Part Number 2: 2069546; Supplier 3: Arrow; Supplier Part Number 3: NX3008NBKW,115
R7 R8 R11 R12 R19 R20 = RC0603FR-0722RL: as R2 on sheet MCU; Manufacturer: YAGEO (PHYCOMP); Manufacturer Part Number: RC0603FR-0722RL; RoHS: YES; Stock 1: 33025; Pricing 1: 10=0.0102, 100=0.0068, 500=0.0051, 1000=0.0041, 2500=0.0034 (GBP); Resistance: 22R; Resistance Tolerance: ± 1%; Packaging: Cut Tape; Resistor Element Material: Thick Film; Automotive Qualification Standard: -; MSL: MSL 1 - Unlimited; Operating Temperature Max: 155; Operating Temperature Min: -55; Operating Temperature Range: -55°C to +155; Temperature Coeff. +: 100; Temperature Coeff. -: 100; Tolerance +: 1%; Tolerance -: 1%; ComponentLink1URL: http://www.farnell.com/datasheets/2167052.pdf; ComponentLink1Description: http://www.farnell.com/datasheets/2167052.pdf; ComponentLink2URL: http://www.farnell.com/cad/1555248.zip; ComponentLink2Description: http://www.farnell.com/cad/1555248.zip; Supplier 1: Mouser; Supplier Part Number 1: 603-RC0603FR-0722RL; Supplier 2: Farnell; Supplier Part Number 2: 9238280; Supplier 3: Digi-Key; Supplier Part Number 3: 311-22.0HRCT-ND
R9 R10 R14 R15 R22 R23 = RC0603FR-07150KL: YAGEO - RC0603FR-07150KL - RES, 150K, 1%, 0.1W, 0603, THICK FILM; Product Range: RC Series; Voltage Rating: 75; Resistor Case Style: 0603 [1608 Metric]; Power Rating: 100; Temperature Coefficient: ± 100; SVHC: No SVHC (27-Jun-2018); External Depth: 0.45; External Length / Height: 1.6; External Width: 0.8; Full Power Rating Temperature: 70; No. of Pins: 2; Reel Quantity: 5000; Resistor Mounting: Surface Mount Device; Voltage Rating V DC: 50V<!--FANDB--><div class="features-and-benefits-container"><div class="features-and-benefits-desc-container"><span class="features-and-benefits-container-desc">SMD Chip Resistor, 150 kohm, RC Series, 75 V, Thick Film, 0603 [1608 Metric], 100 mW</span></div><div class="features-and-benefits-description"><span class="features-benefits-value">The Yageo RC_L series resistors are general purpose thick film chip resistors with lead free terminations made by thick film process. The resistance range includes E24 and E96 decade values from 1ohm to 100Mohm. These resistors are constructed on top of a high grade ceramic body.</span></div><div class="features-and-benefits-list"><ul class="features-and-benefits-list-list"><li class="features-and-benefits-list-item">EIA 0075, 0100, 0201, 0402, 0603, 0805, 1206, 1210, 1218, 2010, 2512 case sizes available</li><li class="features-and-benefits-list-item">Small chip sizes save PCB space</li><li class="features-and-benefits-list-item">Rated voltage range of 10V to 200V</li><li class="features-and-benefits-list-item">Maximum power rating of 2W</li><li class="features-and-benefits-list-item">Available in ±0.1%, ±0.5%, ±1% and ±5% tolerance</li><li class="features-and-benefits-list-item">High component and equipment reliability</li><li class="features-and-benefits-list-item">Forbidden materials are not used in products/production</li><li class="features-and-benefits-list-item">-55°C to 155°C temperature range for RC0402 to RC2512 and -55°C to 125°C for RC0075 to RC0201; Manufacturer: YAGEO; Manufacturer Part Number: RC0603FR-07150KL; RoHS: YES; Pricing 1: 10=0.678, 100=0.557, 500=0.39, 1000=0.326, 2500=0.244 (EUR); Resistance: 150k; Resistor Element Material: Thick Film; Resistance Tolerance: ± 1%; Automotive Qualification Standard: -; MSL: MSL 1 - Unlimited; Operating Temperature Max: 155; Operating Temperature Min: -55; Operating Temperature Range: -55°C to +155; Temperature Coeff. +: 100; Temperature Coeff. -: 100; Tolerance +: 1%; Tolerance -: 1%; ComponentLink1URL: http://www.farnell.com/datasheets/2167052.pdf; ComponentLink1Description: http://www.farnell.com/datasheets/2167052.pdf; ComponentLink2URL: http://www.farnell.com/cad/1555201.zip; ComponentLink2Description: http://www.farnell.com/cad/1555201.zip; Supplier 1: Mouser; Supplier Part Number 1: 603-RC0603FR-07150KL; Supplier 2: Farnell; Supplier Part Number 2: 9238743; Supplier 3: Digi-Key; Supplier Part Number 3: 311-150KHRCT-ND
R13 R16-R18 R21 R24 = RCS060312K0FKEA: as R1 on sheet MCU; Manufacturer Part Number: RCS060312K0FKEA; RoHS: RoHS Compliant; Category: Resistors; Stock 1: 0; Pricing 1: 5000=0.01664, 10000=0.01513 (USD); Packaging: Tape & Reel (TR); Part Status: Active; Tolerance: ±1%; Composition: Thick Film; Features: Automotive AEC-Q200, Pulse Withstanding; Operating Temperature: -55°C ~ 155°C; Package / Case: 0603 (1608 Metric); Supplier Device Package: 0603; Size / Dimension: 0.061" L x 0.033" W (1.55mm x 0.85mm); Height - Seated (Max): 0.020" (0.50mm); Failure Rate: -; ComponentLink1URL: http://www.vishay.com/docs/20065/rcse3.pdf; ComponentLink1Description: http://www.vishay.com/docs/20065/rcse3.pdf; Resistance: 12k; Supplier 1: Mouser; Supplier Part Number 1: 71-RCS060312K0FKEA; Supplier 2: Farnell; Supplier Part Number 2: 3294375; Supplier 3: Digi-Key; Supplier Part Number 3: RCS060312K0FKEA-ND